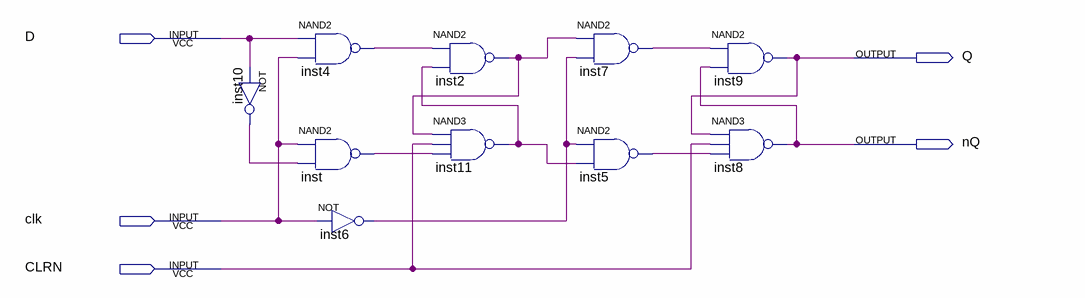
[diagram p0: schematic sheet]
// Quartus schematic D_FlipFlop.bdf as structural Verilog: 10 symbols, 5 pins
module D_FlipFlop (
  input  D,
  input  clk,
  input  CLRN,
  output Q,
  output nQ
);

  wire inst2_out, inst4_out, inst5_out, inst6_out, inst7_out, inst10_out, inst11_out, inst_out;

  not inst10 (inst10_out, D);
  nand inst4 (inst4_out, D, clk);
  nand inst (inst_out, clk, inst10_out);
  not inst6 (inst6_out, clk);
  nand inst2 (inst2_out, inst4_out, inst11_out);
  nand inst11 (inst11_out, inst2_out, CLRN, inst_out);
  nand inst7 (inst7_out, inst2_out, inst6_out);
  nand inst5 (inst5_out, inst6_out, inst11_out);
  nand inst9 (Q, inst7_out, nQ);
  nand inst8 (nQ, Q, CLRN, inst5_out);
endmodule
